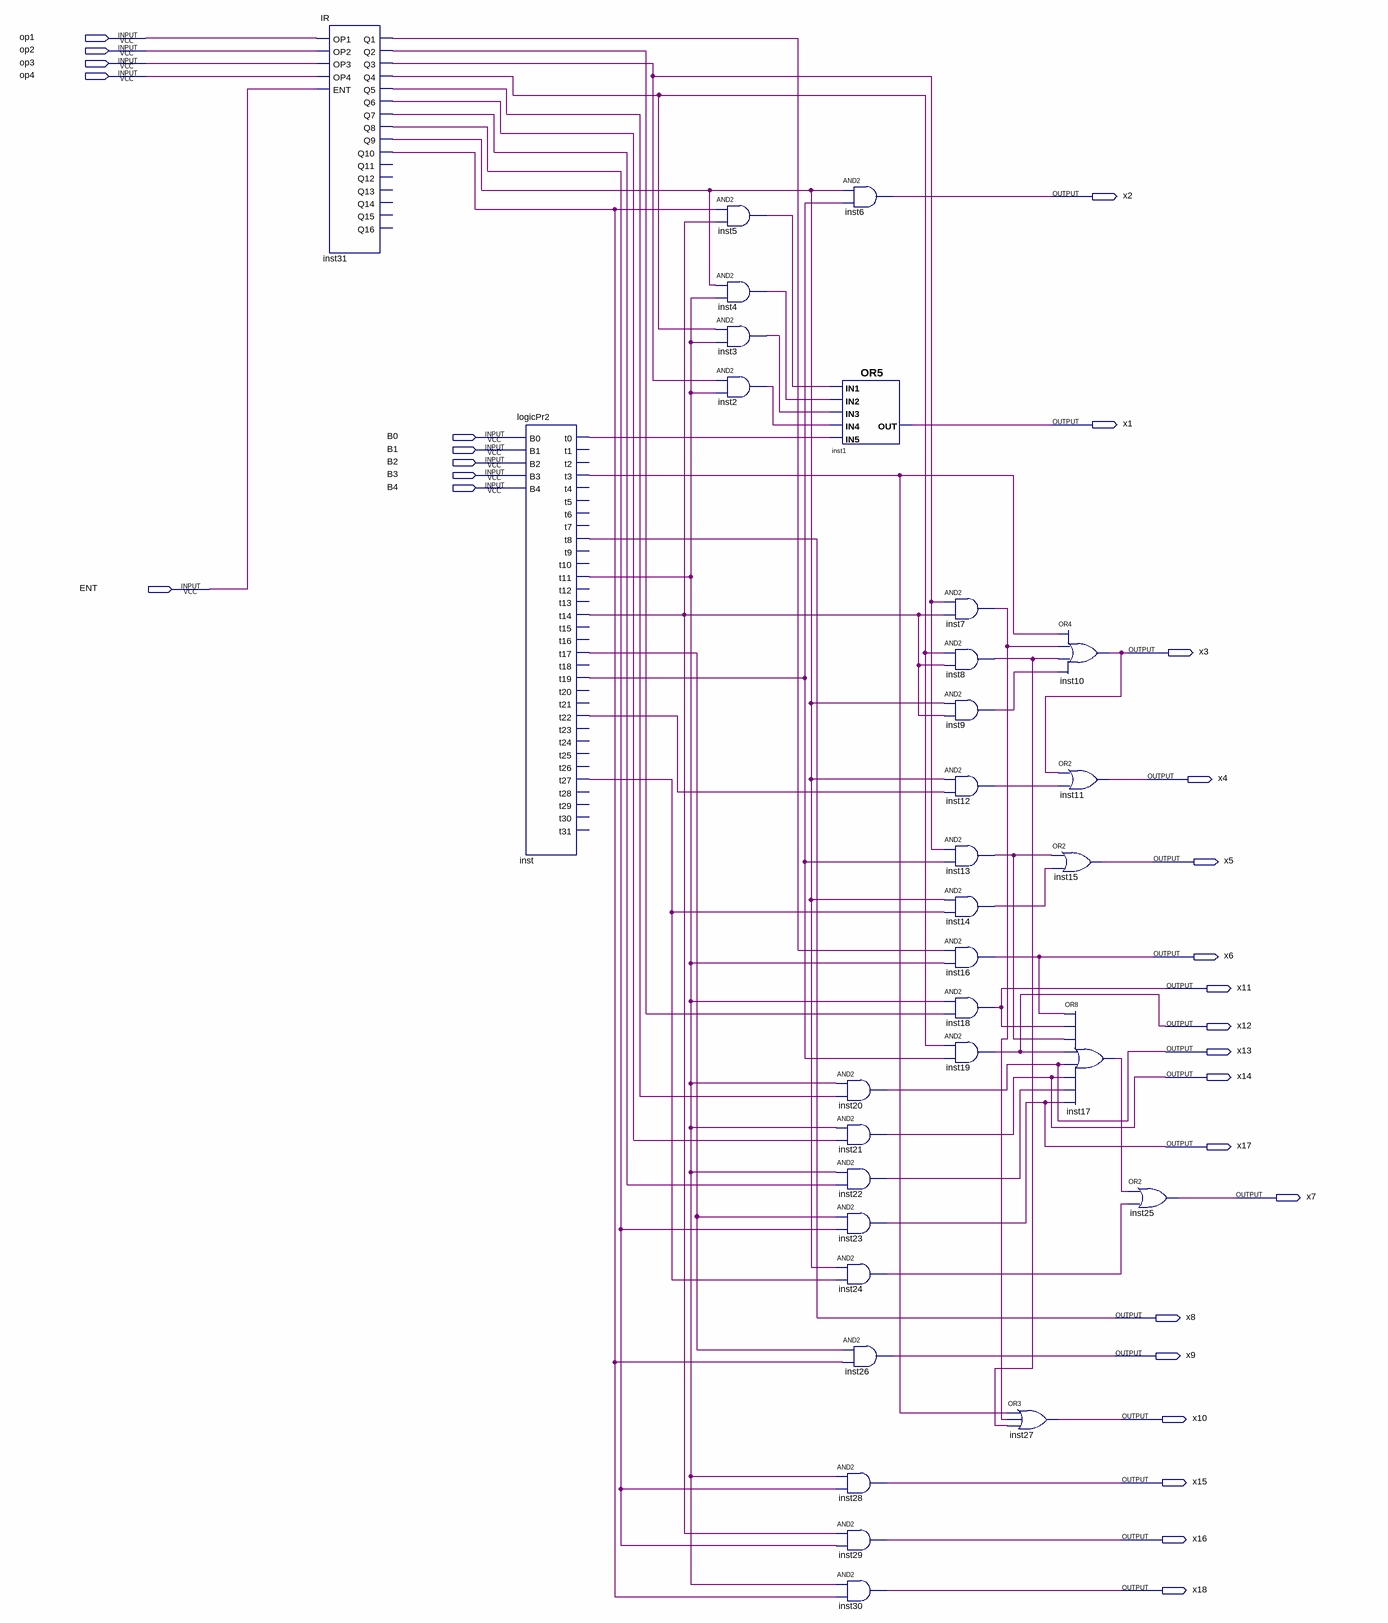
[diagram p0: schematic sheet]
// Quartus schematic logicProcess.bdf as structural Verilog: 32 symbols, 28 pins
module logicProcess (
  input  op1,
  input  op2,
  input  op3,
  input  op4,
  input  B0,
  input  B1,
  input  B2,
  input  B3,
  input  B4,
  input  ENT,
  output x2,
  output x1,
  output x3,
  output x4,
  output x5,
  output x6,
  output x11,
  output x12,
  output x13,
  output x14,
  output x17,
  output x7,
  output x8,
  output x9,
  output x10,
  output x15,
  output x16,
  output x18
);

  wire inst2_out, inst3_out, inst4_out, inst5_out, inst7_out, inst8_out, inst9_out, inst12_out, inst13_out,
       inst14_out, inst17_out, inst22_out, inst24_out, inst31_q1, inst31_q2, inst31_q3, inst31_q4, inst31_q5,
       inst31_q6, inst31_q7, inst31_q8, inst31_q9, inst31_q10, inst_t0, inst_t3, inst_t11, inst_t14,
       inst_t17, inst_t19, inst_t22, inst_t27;

  IR inst31 (
    .OP1(op1), .OP2(op2), .OP3(op3), .OP4(op4), .ENT(ENT), .Q1(inst31_q1), .Q2(inst31_q2), .Q3(inst31_q3),
    .Q4(inst31_q4), .Q5(inst31_q5), .Q6(inst31_q6), .Q7(inst31_q7), .Q8(inst31_q8), .Q9(inst31_q9),
    .Q10(inst31_q10));  // open: Q11, Q12, Q13, Q14, Q15, Q16
  logicPr2 inst (
    .B0(B0), .B1(B1), .B2(B2), .B3(B3), .B4(B4), .t0(inst_t0), .t3(inst_t3), .t8(x8), .t11(inst_t11),
    .t14(inst_t14), .t17(inst_t17), .t19(inst_t19), .t22(inst_t22), .t27(inst_t27));  // open: t1, t2, t4, t5, t6, t7, t9, t10, t12, t13, t15, t16, t18, t20, t21, t23, t24, t25, t26, t28, t29, t30, t31
  and inst5 (inst5_out, inst31_q10, inst_t14);
  and inst4 (inst4_out, inst31_q9, inst_t11);
  and inst3 (inst3_out, inst31_q4, inst_t11);
  and inst2 (inst2_out, inst31_q3, inst_t11);
  and inst6 (x2, inst31_q9, inst_t19);
  or inst1 (x1, inst5_out, inst4_out, inst3_out, inst2_out, inst_t0);
  and inst20 (x13, inst_t11, inst31_q5);
  and inst21 (x14, inst_t11, inst31_q6);
  and inst22 (inst22_out, inst_t11, inst31_q7);
  and inst23 (x17, inst_t17, inst31_q8);
  and inst24 (inst24_out, inst31_q9, inst_t27);
  and inst26 (x9, inst_t17, inst31_q10);
  and inst28 (x15, inst_t11, inst31_q8);
  and inst29 (x16, inst_t14, inst31_q8);
  and inst30 (x18, inst_t11, inst31_q10);
  and inst7 (inst7_out, inst31_q3, inst_t14);
  and inst8 (inst8_out, inst31_q4, inst_t14);
  and inst9 (inst9_out, inst31_q9, inst_t14);
  and inst12 (inst12_out, inst31_q9, inst_t22);
  and inst13 (inst13_out, inst31_q3, inst_t19);
  and inst14 (inst14_out, inst31_q9, inst_t27);
  and inst16 (x6, inst31_q1, inst_t11);
  and inst18 (x11, inst_t11, inst31_q2);
  and inst19 (x12, inst31_q4, inst_t19);
  or inst27 (x10, inst_t3, inst7_out, inst8_out);
  or inst10 (x3, inst_t3, inst7_out, inst8_out, inst9_out);
  or inst11 (x4, x3, inst12_out);
  or inst15 (x5, inst13_out, inst14_out);
  or inst17 (inst17_out, x6, x11, inst13_out, x12, x13, x14, inst22_out, x17);
  or inst25 (x7, inst17_out, inst24_out);
endmodule
